# Altium schematic sheet LINEARDriver_Amp.SchDoc
size 594 x 420 mm; DocumentNumber: BSV.23-KUBODRIVER Э3; SheetNumber: 2; Format: A2
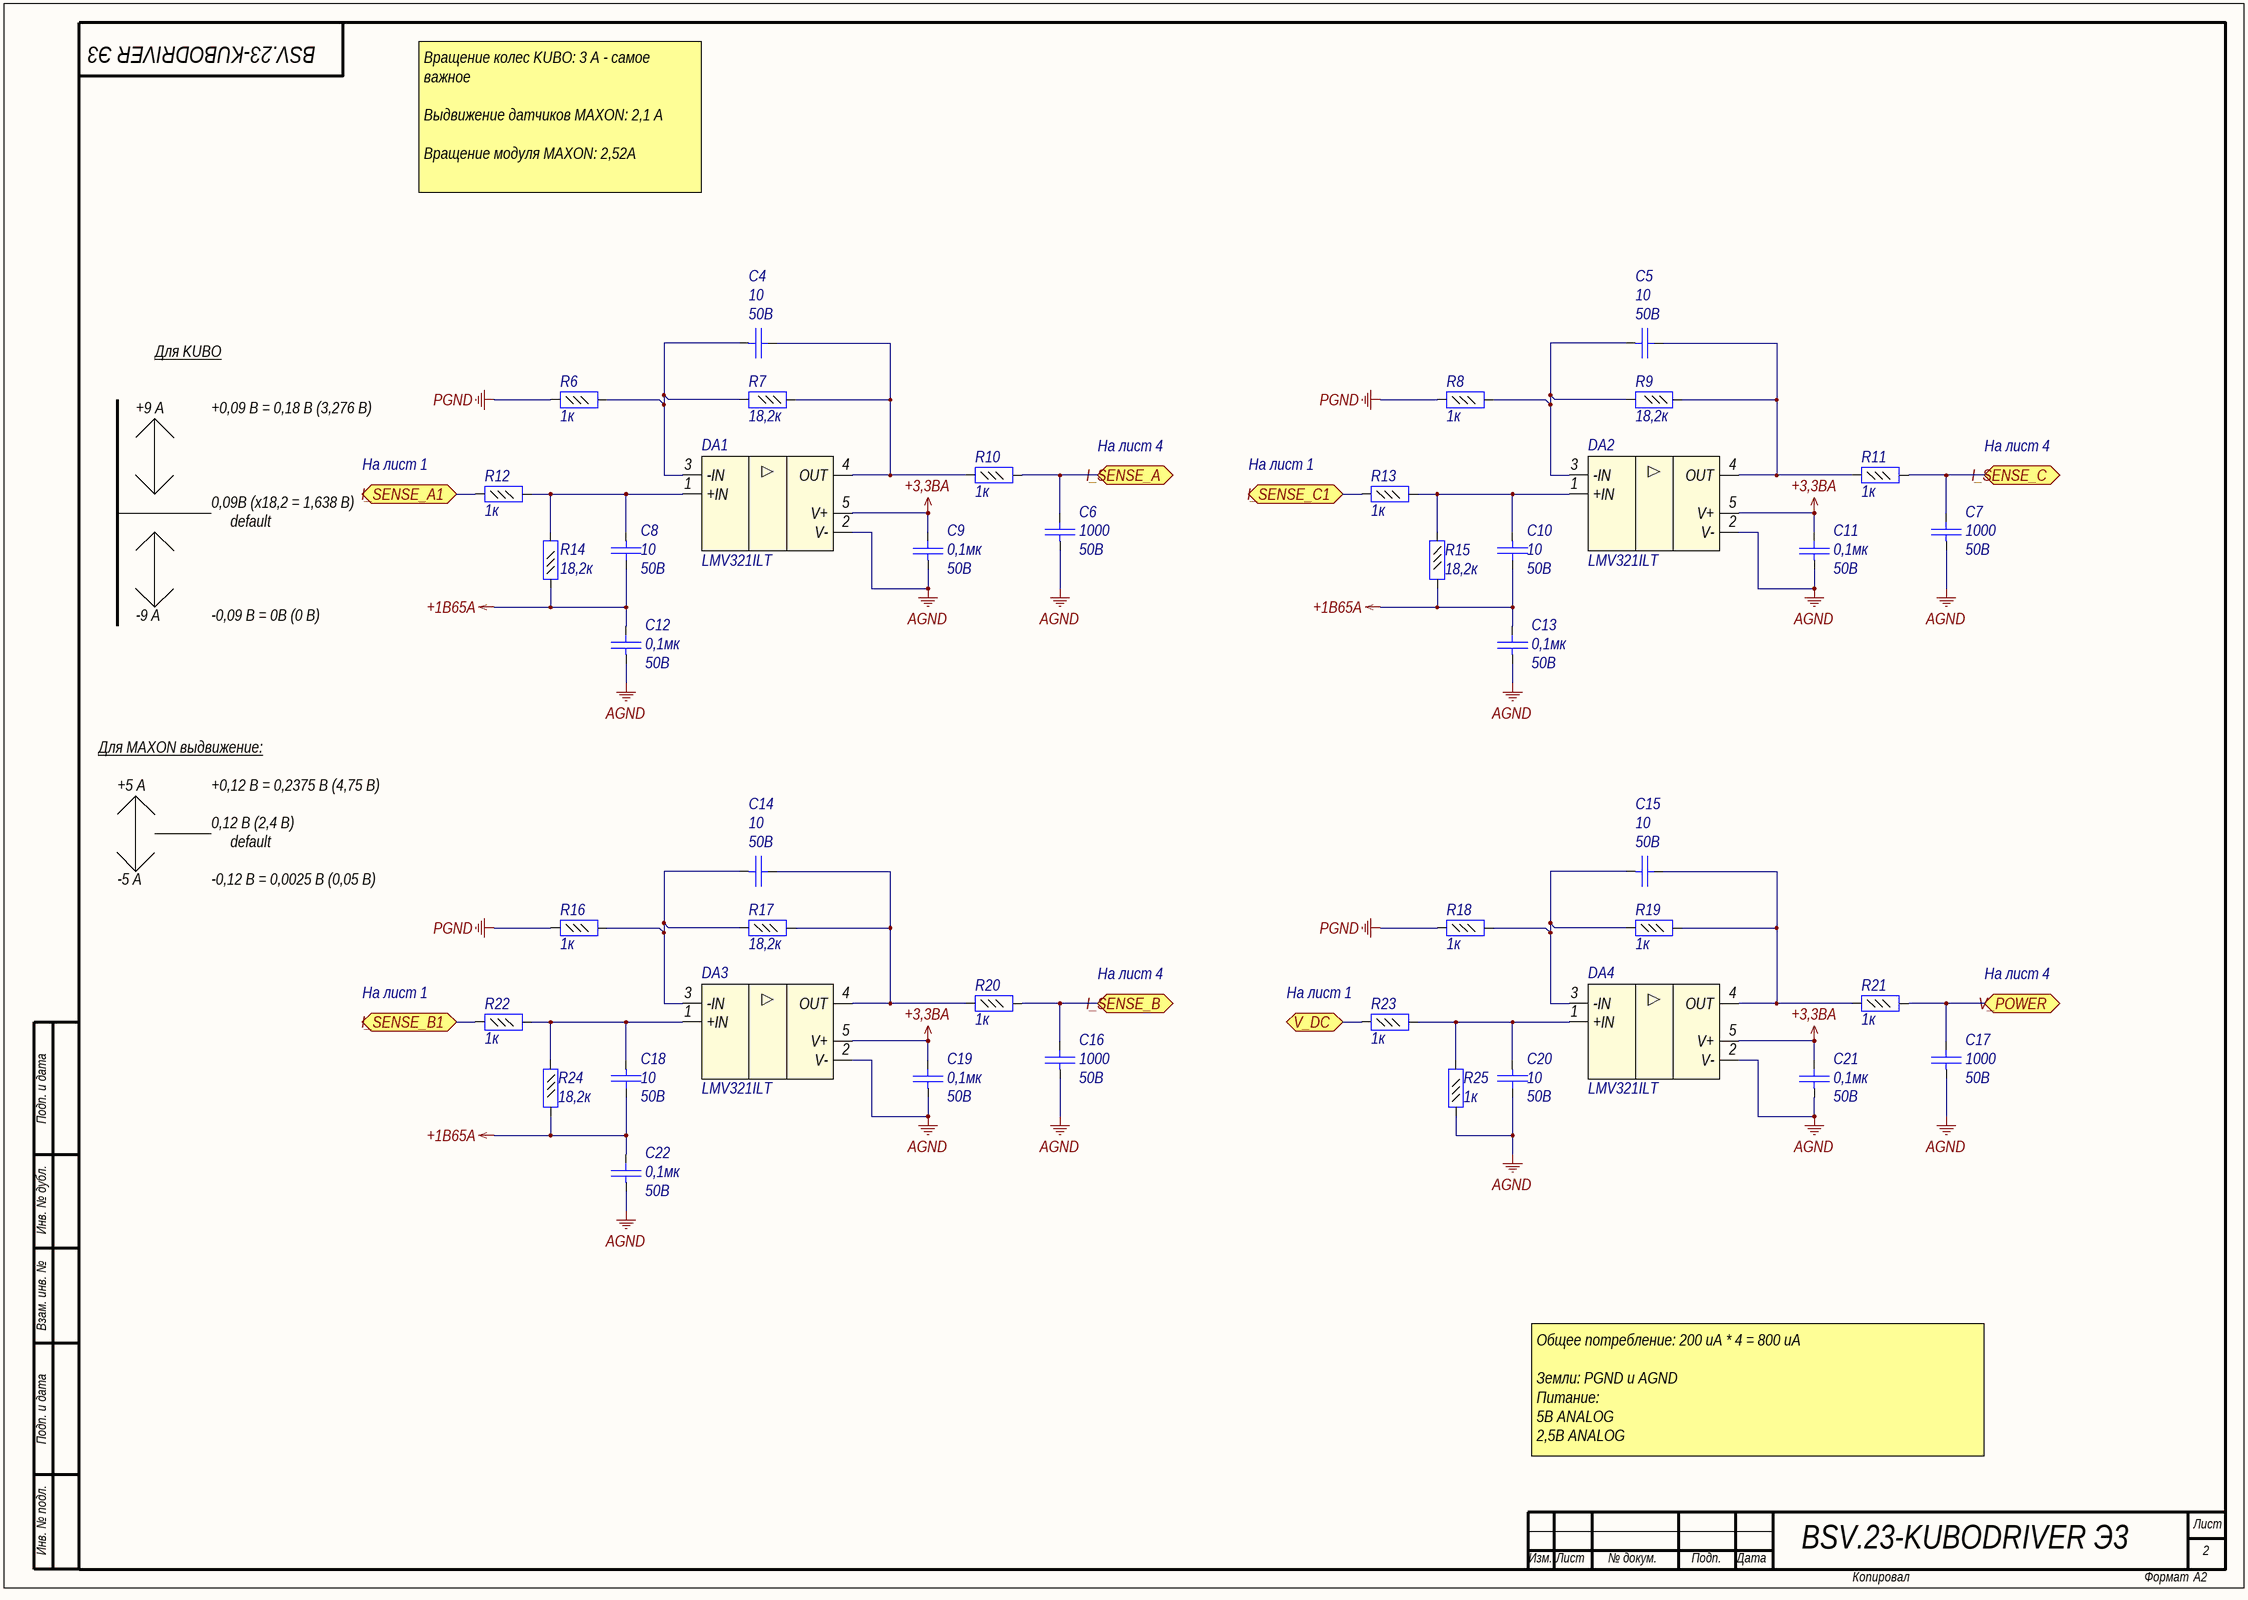
[diagram p0: LINEARDriver_Amp.SchDoc]

## Parts
C4  value 10  Voltage: 50B  [C0402]  (hidden comment: Capacitor)
C5  value 10  Voltage: 50B  [C0402]  (hidden comment: Capacitor)
C6  value 1000  Voltage: 50B  [C0402]  (hidden comment: Capacitor)
C7  value 1000  Voltage: 50B  [C0402]  (hidden comment: Capacitor)
C8  value 10  Voltage: 50B  [C0402]  (hidden comment: Capacitor)
C9  value 0,1мк  Voltage: 50В  [C0402]  (hidden comment: Capacitor)
C10  value 10  Voltage: 50B  [C0402]  (hidden comment: Capacitor)
C11  value 0,1мк  Voltage: 50В  [C0402]  (hidden comment: Capacitor)
C12  value 0,1мк  Voltage: 50В  [C0402]  (hidden comment: Capacitor)
C13  value 0,1мк  Voltage: 50В  [C0402]  (hidden comment: Capacitor)
C14  value 10  Voltage: 50B  [C0402]  (hidden comment: Capacitor)
C15  value 10  Voltage: 50B  [C0402]  (hidden comment: Capacitor)
C16  value 1000  Voltage: 50B  [C0402]  (hidden comment: Capacitor)
C17  value 1000  Voltage: 50B  [C0402]  (hidden comment: Capacitor)
C18  value 10  Voltage: 50B  [C0402]  (hidden comment: Capacitor)
C19  value 0,1мк  Voltage: 50В  [C0402]  (hidden comment: Capacitor)
C20  value 10  Voltage: 50B  [C0402]  (hidden comment: Capacitor)
C21  value 0,1мк  Voltage: 50В  [C0402]  (hidden comment: Capacitor)
C22  value 0,1мк  Voltage: 50В  [C0402]  (hidden comment: Capacitor)
DA1  LMV321ILT  [SOT23-5]
DA2  LMV321ILT  [SOT23-5]
DA3  LMV321ILT  [SOT23-5]
DA4  LMV321ILT  [SOT23-5]
R6  value 1к  [R0402]  (hidden comment: Resistor_0,062Вт)
R7  value 18,2к  [R0402]  (hidden comment: Resistor_0,062Вт)
R8  value 1к  [R0402]  (hidden comment: Resistor_0,062Вт)
R9  value 18,2к  [R0402]  (hidden comment: Resistor_0,062Вт)
R10  value 1к  [R0402]  (hidden comment: Resistor_0,062Вт)
R11  value 1к  [R0402]  (hidden comment: Resistor_0,062Вт)
R12  value 1к  [R0402]  (hidden comment: Resistor_0,062Вт)
R13  value 1к  [R0402]  (hidden comment: Resistor_0,062Вт)
R14  value 18,2к  [R0402]  (hidden comment: Resistor_0,062Вт)
R15  value 18,2к  [R0402]  (hidden comment: Resistor_0,062Вт)
R16  value 1к  [R0402]  (hidden comment: Resistor_0,062Вт)
R17  value 18,2к  [R0402]  (hidden comment: Resistor_0,062Вт)
R18  value 1к  [R0402]  (hidden comment: Resistor_0,062Вт)
R19  value 1к  [R0402]  (hidden comment: Resistor_0,062Вт)
R20  value 1к  [R0402]  (hidden comment: Resistor_0,062Вт)
R21  value 1к  [R0402]  (hidden comment: Resistor_0,062Вт)
R22  value 1к  [R0402]  (hidden comment: Resistor_0,062Вт)
R23  value 1к  [R0402]  (hidden comment: Resistor_0,062Вт)
R24  value 18,2к  [R0402]  (hidden comment: Resistor_0,062Вт)
R25  value 1к  [R0402]  (hidden comment: Resistor_0,062Вт)

## Ports
I_SENSE_A, I_SENSE_A1, I_SENSE_B, I_SENSE_B1, I_SENSE_C, I_SENSE_C1, V_DC, V_POWER

## Nets
+1B65A: C8.2 C10.2 C12.2 C13.2 C18.2 C22.2 R14.1 R15.2 R24.2
+3,3BA: C9.2 C11.2 C19.2 C21.2 DA1.5(V+) DA2.5(V+) DA3.5(V+) DA4.5(V+)
AGND: C6.1 C7.1 C9.1 C11.1 C12.1 C13.1 C16.1 C17.1 C19.1 C20.2 C21.1 C22.1 DA1.2(V-) DA2.2(V-) DA3.2(V-) DA4.2(V-) R25.1
PGND: R6.1 R8.1 R16.1 R18.1
I_SENSE_A: C6.2 R10.2 ; port I_SENSE_A
I_SENSE_A1: R12.1 ; port I_SENSE_A1
I_SENSE_B: C16.2 R20.2 ; port I_SENSE_B
I_SENSE_B1: R22.1 ; port I_SENSE_B1
I_SENSE_C: C7.2 R11.2 ; port I_SENSE_C
I_SENSE_C1: R13.1 ; port I_SENSE_C1
V_DC: R23.1 ; port V_DC
V_POWER: C17.2 R21.2 ; port V_POWER
NetC4_1: C4.1 DA1.3(-IN) R6.2 R7.2
NetC4_2: C4.2 DA1.4(OUT) R7.1 R10.1
NetC5_1: C5.1 DA2.3(-IN) R8.2 R9.2
NetC5_2: C5.2 DA2.4(OUT) R9.1 R11.1
NetC8_1: C8.1 DA1.1(+IN) R12.2 R14.2
NetC10_1: C10.1 DA2.1(+IN) R13.2 R15.1
NetC14_1: C14.1 DA3.3(-IN) R16.2 R17.1
NetC14_2: C14.2 DA3.4(OUT) R17.2 R20.1
NetC15_1: C15.1 DA4.3(-IN) R18.2 R19.1
NetC15_2: C15.2 DA4.4(OUT) R19.2 R21.1
NetC18_1: C18.1 DA3.1(+IN) R22.2 R24.1
NetC20_1: C20.1 DA4.1(+IN) R23.2 R25.2

## Notes on the sheet
- Вращение колес KUBO: 3 А - самое важное
  Выдвижение датчиков MAXON: 2,1 А
  Вращение модуля MAXON: 2,52А
  Выдвижение УЗ датчика MAXON: 0,748А
- Для KUBO
- +9 А
- +0,09 B = 0,18 B (3,276 B)
- На лист 4
- На лист 1
- 0,09B (x18,2 = 1,638 B)
- default
- -9 А
- -0,09 B = 0B (0 B)
- Для МAXON выдвижение:
- +5 А
- +0,12 B = 0,2375 B (4,75 B)
- 0,12 B (2,4 B)
- -5 А
- -0,12 B = 0,0025 B (0,05 B)
- (near R23) На лист 1
- Подп. и дата
- Инв. № дубл.
- Взам. инв. №
- Общее потребление: 200 uA * 4 = 800 uA
  Земли: PGND и AGND
  Питание:
  5В ANALOG
  2,5B ANALOG
- Инв. № подл.
- Лист
- Изм.
- № докум.
- Подп.
- Дата
- Копировал
- Формат

## Library data of the parts
C4 C5 C8 C10 C14 C15 C18 C20 = cap5: Конденсатор; Part Name: Ceramic; Manufacture: Murata; Part Number: GRM1535C1H100J; id: cap5; TKE: NP0
C6 C7 C16 C17 = cap28: Конденсатор; Part Name: Ceramic; Manufacture: Murata; Part Number: GRM1555C1H102J; id: cap28; TKE: NP0
C9 C11-C13 C19 C21 C22 = cap277: Конденсатор; Part Name: Ceramic; Manufacture: Murata; Part Number: GRM155R71H104KE14D; id: cap277; TKE: X7R; tga: 0,10%
DA1-DA4 = amp10: HIGH-DRIVE OPERATIONAL AMPLIFIERS WITH SHUTDOWN; Part Name: Micropower / Operational Amplifiers; Manufacture: ST Microelectronics; id: amp10; Rail-to-rail: yes; Supply Voltage: 2,7-6B; Supply Current max: 200uA; Bandwidth: 1MHz; Input Bias Current: 10nA; CMRR: 85dB; PSRR: 80dB; Offset voltage: 0,1mB; Channels: 1; Part Number: LMV321ILT
R6 R8 R10-R13 R16 R18-R23 R25 = res270: Резистор; Manufacture: Yageo; Part Number: RC0402FR-071KL; id: res270; Accuracy: 0,01; Part Name: Resistor; Power: 0,062Вт
R7 R9 R14 R15 R17 R24 = res1166: Резистор; Manufacture: Yageo; Part Number: RC0402FR-0718K2L; Accuracy: 0,01; id: res1166; Part Name: Resistor; Power: 0,062Вт